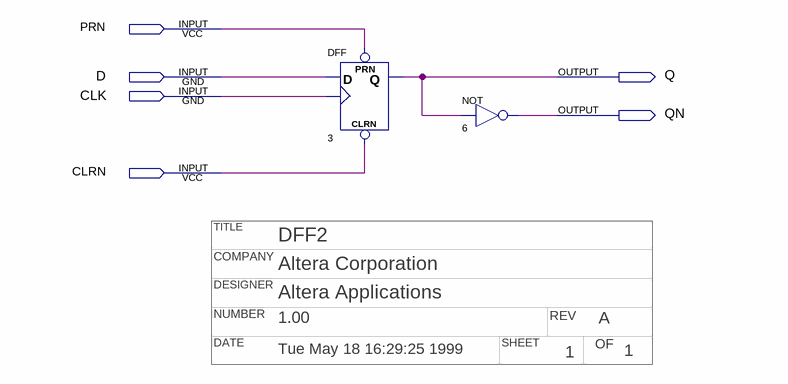
[diagram p0: schematic sheet]
// Quartus schematic dff2.bdf as structural Verilog: 2 symbols, 6 pins
// Title block: TITLE: DFF2; COMPANY: Altera Corporation; DESIGNER: Altera Applications; NUMBER: 1.00; REV: A; DATE: Tue May 18 16:29:25 1999; SHEET: 1; OF: 1
module dff2 (
  input  PRN,
  input  D,
  input  CLK,
  input  CLRN,
  output Q,
  output QN
);

  DFF u_3 (.CLRN(CLRN), .CLK(CLK), .D(D), .PRN(PRN), .Q(Q));
  not u_6 (QN, Q);
endmodule
